# EAGLE schematic onewire (EAGLE 6.6.0)
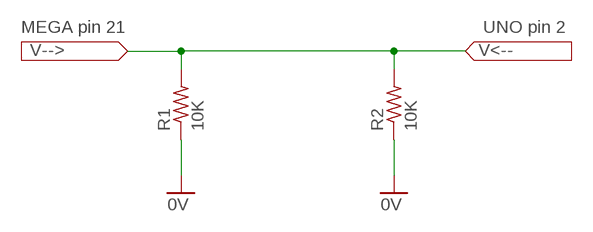
[diagram p0: schematic, sheet 1]

## Parts
R1  10K  R-US_0204/7  [0204/7]
R2  10K  R-US_0204/7  [0204/7]

## Nets
0V: R1.1 R2.1
N$1: R1.2 R2.2

## Notes on the sheet
- MEGA pin 21 | UNO pin 2

## Library data of the parts
R1 R2 = resistor:R-US_: RESISTOR, American symbol